# Altium project Mach cum LED.PrjPcb
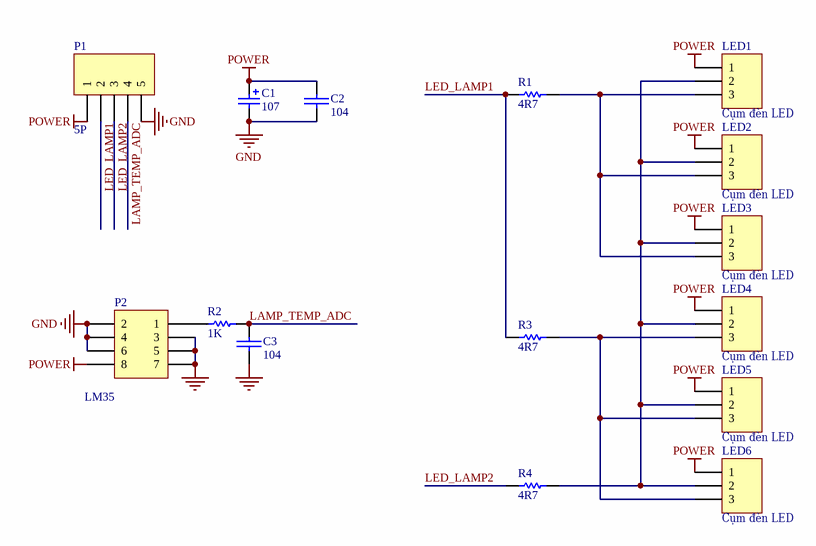
[diagram p0: Mach cum LED.SchDoc]
1 sheet, 15 parts. Net scope: global (net labels, ports and power ports of the same name join across sheets).
Board file: Copy of Mach cum LED.PcbDoc

## Sheet Mach cum LED.SchDoc
size A4

### Parts
C1  value 107  [SMC_D/WA]
C2  value 104  [0805C]
C3  value 104  [0805C]
LED1  Cụm đèn LED  [LED_5730]
LED2  Cụm đèn LED  [LED_5730]
LED3  Cụm đèn LED  [LED_5730]
LED4  Cụm đèn LED  [LED_5730]
LED5  Cụm đèn LED  [LED_5730]
LED6  Cụm đèn LED  [LED_5730]
P1  value 5P  [HDR1X5H]  (hidden comment: Jump đực chân thẳng, 2.54mm 5P)
P2  value LM35  [so-8]  (hidden comment: IC đo nhiệt độ, chân dán 8P LM35)
R1  value 4R7  [2512]
R2  value 1K  [0805DD]
R3  value 4R7  [2512]
R4  value 4R7  [2512]

### Nets
GND: C1.2 C2.2 C3.2 P1.5 P2.2 P2.3 P2.4 P2.5 P2.6 P2.7
POWER: C1.1 C2.1 LED1.1 LED2.1 LED3.1 LED4.1 LED5.1 LED6.1 P1.1 P2.8
LAMP_TEMP_ADC: C3.1 P1.4 R2.2
LED_LAMP1: P1.2 R1.1 R3.1
LED_LAMP2: P1.3 R4.2
NetLED1_2: LED1.2 LED2.2 LED3.2 LED4.2 LED5.2 LED6.2 R4.1
NetLED1_3: LED1.3 LED2.3 LED3.3 R1.2
NetLED4_3: LED4.3 LED5.3 LED6.3 R3.2
NetP2_1: P2.1 R2.1

### Library data of the parts
C1 = Cap Pol1: Polarized Capacitor (Radial); Type1: Tụ hóa chân cắm; Type2: Tụ hóa chân dán; Published: *; LatestRevisionDate: *; LatestRevisionNote: *; PackageReference: *; Publisher: *
C2 C3 = CAP: Type1: Tụ điện dán 0805; Type2: Tụ điện chân cắm
LED1-LED6 = Header 3: Header, 3-Pin; LatestRevisionDate: 17-Jul-2002; LatestRevisionNote: Re-released for DXP Platform.; Publisher: Altium Limited
P1 = Header 5H: Header, 5-Pin, Right Angle; LatestRevisionDate: 17-Jul-2002; LatestRevisionNote: Re-released for DXP Platform.; Publisher: Altium Limited
P2 = Header 4X2: Header, 4-Pin, Dual row; LatestRevisionDate: 17-Jul-2002; LatestRevisionNote: Re-released for DXP Platform.; Publisher: Altium Limited
R1-R4 = Res Semi: Semiconductor Resistor; Type1: Điện trở dán 0805; Type2: Điện trở chân cắm 1/4W; Type3: Điện trở chân cắm 2W; Type4: Điện trở dán 2512; Published: *; LatestRevisionDate: *; LatestRevisionNote: *; PackageReference: *; Publisher: *